# Altium schematic sheet power.SchDoc
size A4; SheetNumber: 2; SheetTotal: 5
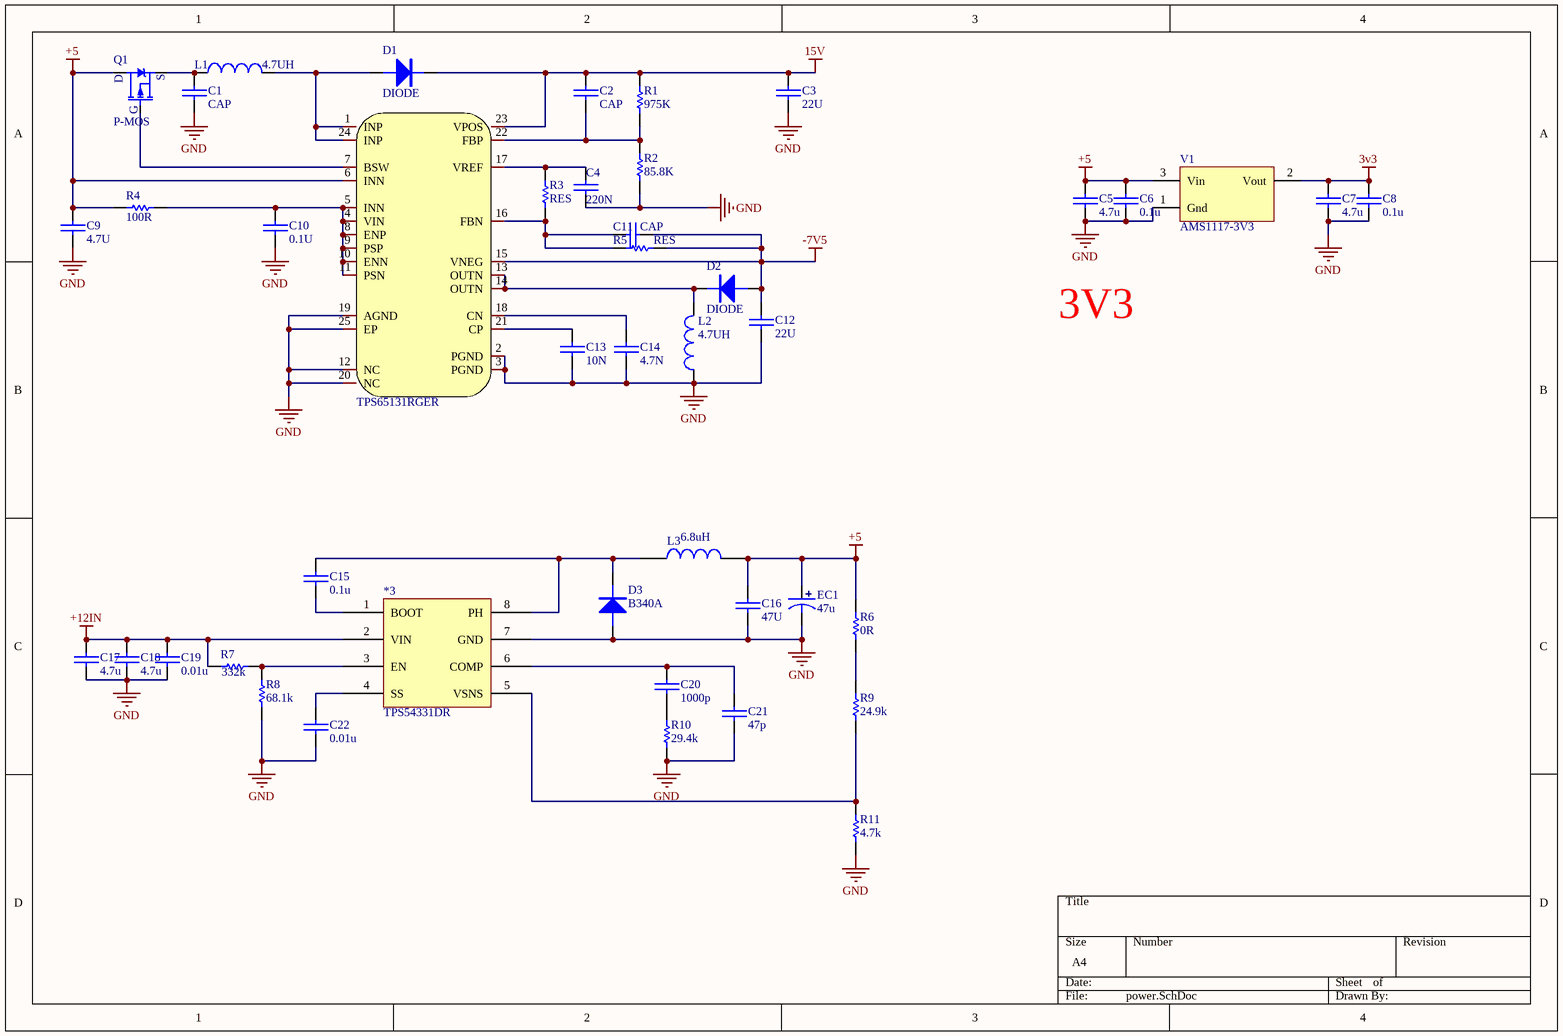
[diagram p0: power.SchDoc]

## Parts
*3  TPS54331DR  [SOIC-8]
C1  CAP  [0603C]
C2  CAP  [0603C]
C3  22U  [0603C]
C4  220N  [0603C]
C5  4.7u  [0603C]
C6  0.1u  [0603C]
C7  4.7u  [0603C]
C8  0.1u  [0603C]
C9  4.7U  [0603C]
C10  0.1U  [0603C]
C11  CAP  [0603C]
C12  22U  [0603C]
C13  10N  [0603C]
C14  4.7N  [0603C]
C15  0.1u  [0603C]
C16  47U  [0603C]
C17  4.7u  [0603C]
C18  4.7u  [0603C]
C19  0.01u  [0603C]
C20  1000p  [0603C]
C21  47p  [0603C]
C22  0.01u  [0603C]
D1  DIODE  [SOD-123]
D2  DIODE  [SOD-123]
D3  B340A  [SMA/DO-214AC]
EC1  47u  [SMD-EC6.3X6.3X10]
L1  4.7UH  [L-SMD-0420]
L2  4.7UH  [L-SMD-0420]
L3  6.8uH  [L-SMD-0630]
Q1  P-MOS  [SOT23]
R1  975K  [0603R]
R2  85.8K  [0603R]
R3  RES  [0603R]
R4  100R  [0603R]
R5  RES  [0603R]
R6  0R  [0603R]
R7  332k  [0603R]
R8  68.1k  [0603R]
R9  24.9k  [0603R]
R10  29.4k  [0603R]
R11  4.7k  [0603R]
U1  TPS65131RGER  [QFN-24_L4.0-W4.0-P0.50-TL-EP2.6]
V1  AMS1117-3V3  [SOT223_L]

## Nets
3v3: C7.2 C8.2 V1.2(Vout)
15V: C2.2 C3.2 D1.K R1.2 U1.23(VPOS)
+5: C5.2 C6.2 C9.2 C16.2 EC1.1 L3.2 Q1.3(D) R4.2 R6.2 U1.6(INN) V1.3(Vin)
+12IN: *3.2(VIN) C17.2 C18.2 C19.2 R7.2
-7V5: C11.1 C12.1 D2.A R5.1 U1.15(VNEG)
GND: *3.7(GND) C1.1 C3.1 C4.1 C5.1 C6.1 C7.1 C8.1 C9.1 C10.1 C12.2 C13.2 C14.2 C16.1 C17.1 C18.1 C19.1 C21.1 C22.1 D3.A EC1.2 L2.1 R2.1 R8.1 R10.1 R11.1 U1.2(PGND) U1.3(PGND) U1.12(NC) U1.19(AGND) U1.20(NC) U1.25(EP) V1.1(Gnd)
Net*3_1: *3.1(BOOT) C15.1
Net*3_3: *3.3(EN) R7.1 R8.2
Net*3_4: *3.4(SS) C22.2
Net*3_5: *3.5(VSNS) R9.1 R11.2
Net*3_6: *3.6(COMP) C20.2 C21.2
Net*3_8: *3.8(PH) C15.2 D3.K L3.1
NetC1_2: C1.2 L1.1 Q1.2(S)
NetC2_1: C2.1 R1.1 R2.2 U1.22(FBP)
NetC4_2: C4.2 R3.2 U1.17(VREF)
NetC10_2: C10.2 R4.1 U1.4(VIN) U1.5(INN) U1.8(ENP) U1.9(PSP) U1.10(ENN) U1.11(PSN)
NetC11_2: C11.2 R3.1 R5.2 U1.16(FBN)
NetC13_1: C13.1 U1.21(CP)
NetC14_1: C14.1 U1.18(CN)
NetC20_1: C20.1 R10.2
NetD1_A: D1.A L1.2 U1.1(INP) U1.24(INP)
NetD2_K: D2.K L2.2 U1.13(OUTN) U1.14(OUTN)
NetQ1_1: Q1.1(G) U1.7(BSW)
NetR6_1: R6.1 R9.2

## Notes on the sheet
- 3V3

## Library data of the parts
*3 = TPS54331DR: 降压型DC-DC
C1-C22 = CAP: 无极性电容
D1-D3 = DIODE: 普通二极管
EC1 = ECAP: 贴片电解电容
L1 L2 = L: 小功率贴片电感
L3 = L: INDUCTOR
Q1 = P-MOS: P沟道场效应管
R1-R11 = RES: 电阻
U1 = TPS65131RGER: 具有正负（双路）输出的 1950mA 升压电流，用于 OLED 和 CCD 传感器; Manufacturer: TI(德州仪器); Add into BOM: yes; Voltage - Output (Min/Fixed): 3.2V, -2V; Voltage - Output (Max): 15V, -15V; Current - Output: 1.8A (Switch); Frequency - Switching: 1.38MHz; Output Type: Adjustable; Number of Outputs: 2; Voltage - Input (Min): 2.7V; Voltage - Input (Max): 5.5V; Topology: Boost, Buck-Boost; Synchronous Rectifier: No; Function: Step-Up, Step-Up/Step-Down; Output Configuration: Positive and Negative (Dual Rail); Name: TPS65131RGER; Symbol: TPS65131RGER; Device: TPS65131RGER; LCSC Part Name: TPS65131RGER; Supplier Part: C87663; Manufacturer Part: TPS65131RGER; Supplier Footprint: QFN-24_4x4x05P; JLCPCB Part Class: Extended Part; Datasheet: https://atta.szlcsc.com/upload/public/pdf/source/20161123/1479873108320.pdf; Supplier: LCSC; Convert to PCB: yes
V1 = AMS1117: LDO; BOM名称: 稳压芯片; 封装库来自淘宝卖家：黄晶宝石: 其他店铺购入的买家，请立即申请退款，本店现金奖励200~1000元